# EAGLE schematic shiva (EAGLE 7.7.0)
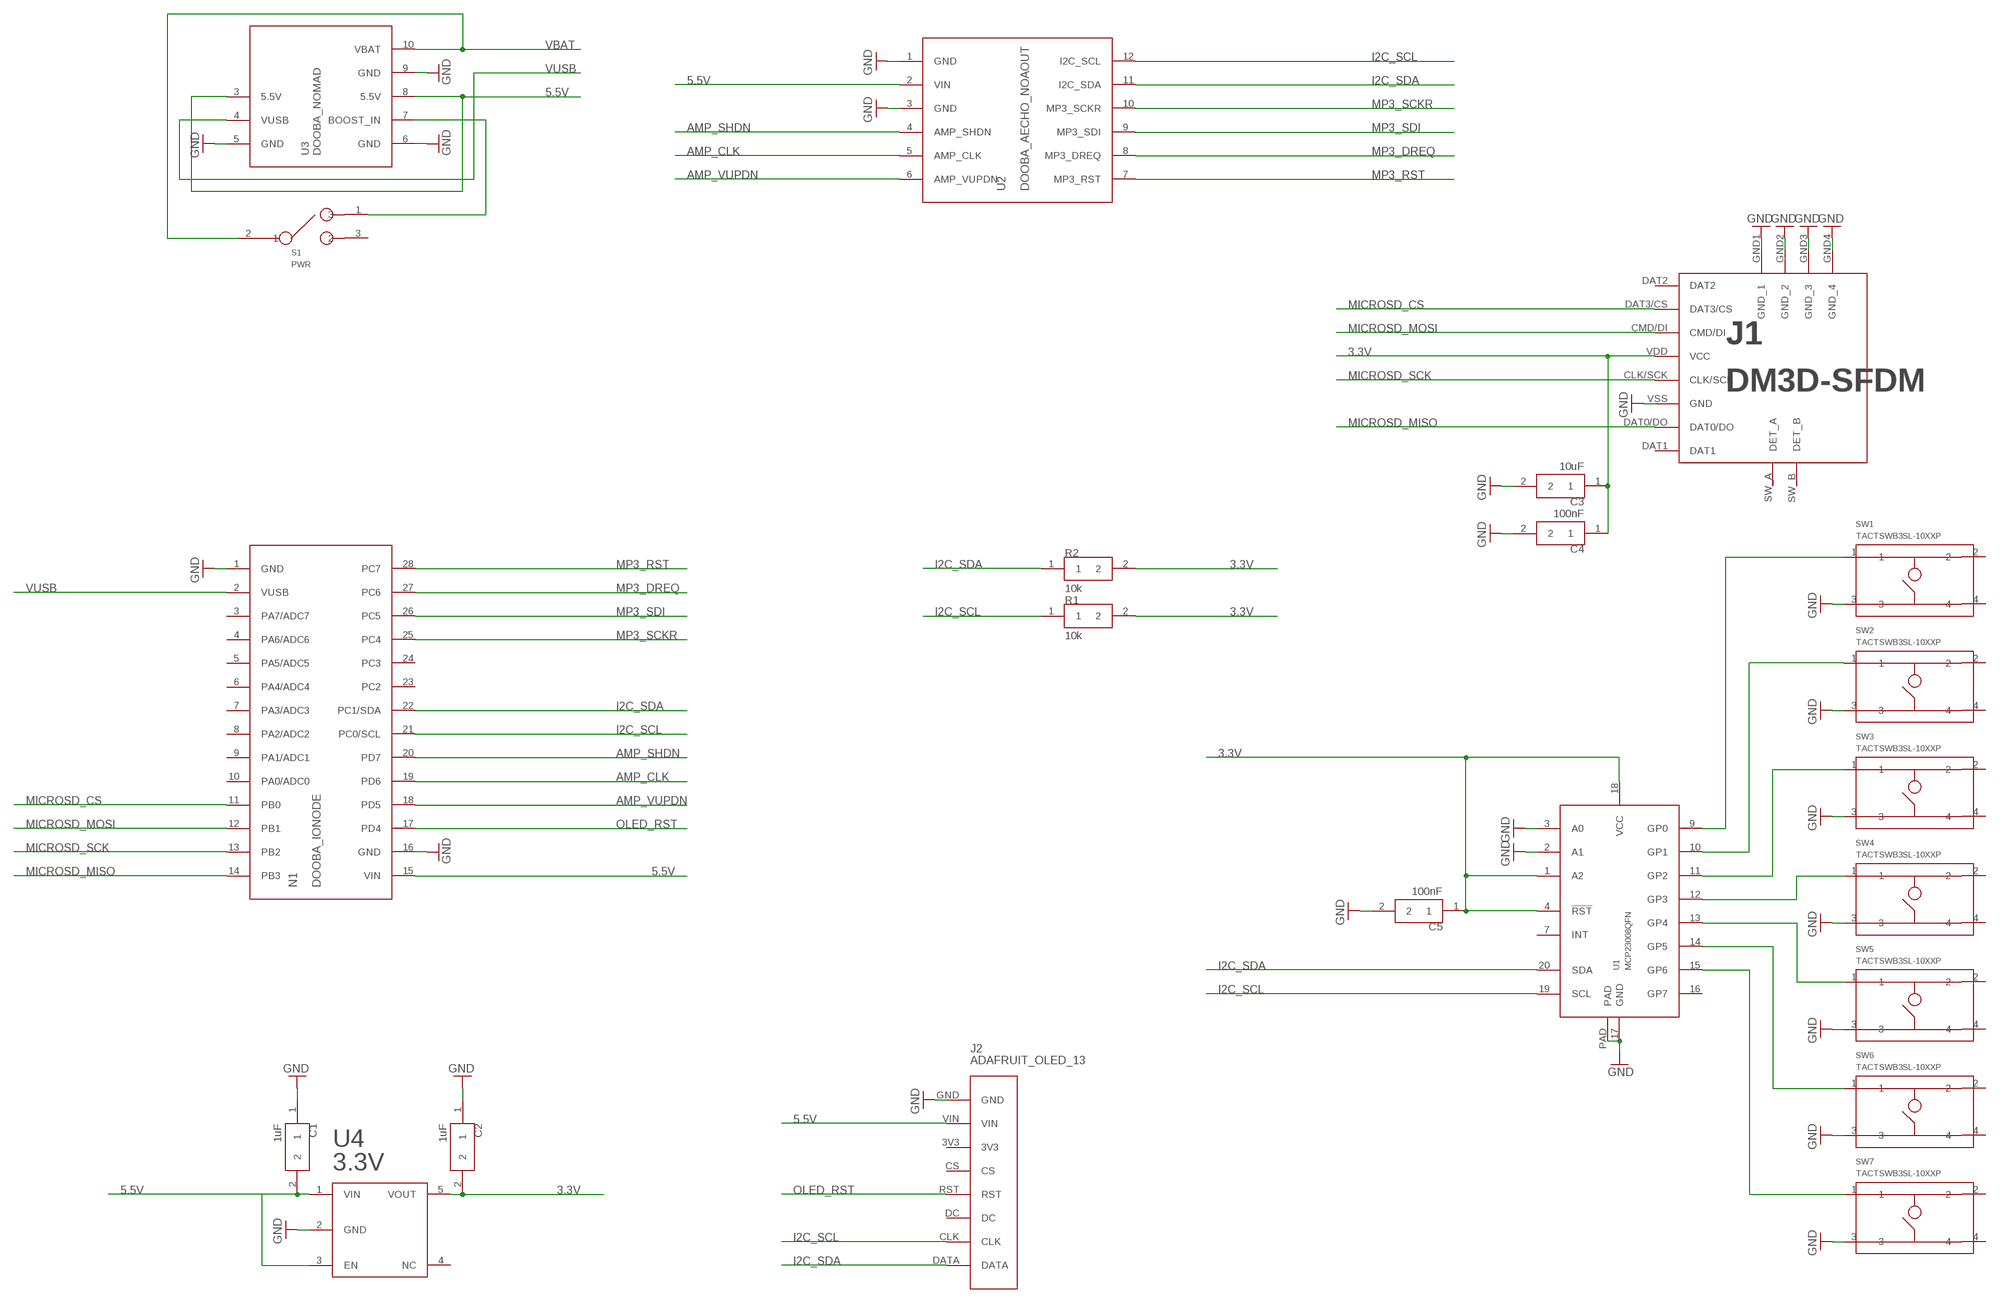
[diagram p0: schematic, sheet 1]

## Parts
C1  1uF  CAP0805  [0805]
C2  1uF  CAP0805  [0805]
C3  10uF  CAP0805  [0805]
C4  100nF  CAP0805  [0805]
C5  100nF  CAP0805  [0805]
J1  DM3D-SFDM  [DM3D-SF]
J2  ADAFRUIT_OLED_13  [ADAFRUIT_OLED_13]
N1  DOOBA_IONODE  [DOOBA_IONODE]
R1  10k  RES0805  [0805]
R2  10k  RES0805  [0805]
S1  PWR  SWITCH_SPDT  [JS102011]
SW1  TACTSWB3SL-10XXP  [B3SL-10XXP]
SW2  TACTSWB3SL-10XXP  [B3SL-10XXP]
SW3  TACTSWB3SL-10XXP  [B3SL-10XXP]
SW4  TACTSWB3SL-10XXP  [B3SL-10XXP]
SW5  TACTSWB3SL-10XXP  [B3SL-10XXP]
SW6  TACTSWB3SL-10XXP  [B3SL-10XXP]
SW7  TACTSWB3SL-10XXP  [B3SL-10XXP]
U1  MCP23008QFN  [20-VQFN]
U2  DOOBA_AECHO_NOAOUT  [DOOBA_AECHO_NOAOUT]
U3  DOOBA_NOMAD  [DOOBA_NOMAD]
U4  3.3V  LP3985SOT23-5  [SOT23-5]

## Nets
3.3V: C2.2 C3.1 C4.1 C5.1 J1.VDD(VCC) R1.2 R2.2 U1.1(A2) U1.4(!RST) U1.18(VCC) U4.5(VOUT)
5.5V: C1.2 J2.VIN N1.15(VIN) U2.2(VIN) U3.3(5.5V) U3.8(5.5V) U4.1(VIN) U4.3(EN)
AMP_CLK: N1.19(PD6) U2.5(AMP_CLK)
AMP_SHDN: N1.20(PD7) U2.4(AMP_SHDN)
AMP_VUPDN: N1.18(PD5) U2.6(AMP_VUPDN)
GND: C1.1 C2.1 C3.2 C4.2 C5.2 J1.GND1(GND_1) J1.GND2(GND_2) J1.GND3(GND_3) J1.GND4(GND_4) J1.VSS(GND) J2.GND N1.1(GND) N1.16(GND) SW1.3 SW2.3 SW3.3 SW4.3 SW5.3 SW6.3 SW7.3 U1.2(A1) U1.3(A0) U1.17(GND) U1.PAD U2.1(GND) U2.3(GND) U3.5(GND) U3.6(GND) U3.9(GND) U4.2(GND)
I2C_SCL: J2.CLK N1.21(PC0/SCL) R1.1 U1.19(SCL) U2.12(I2C_SCL)
I2C_SDA: J2.DATA N1.22(PC1/SDA) R2.1 U1.20(SDA) U2.11(I2C_SDA)
MICROSD_CS: J1.DAT3/CS N1.11(PB0)
MICROSD_MISO: J1.DAT0/DO N1.14(PB3)
MICROSD_MOSI: J1.CMD/DI N1.12(PB1)
MICROSD_SCK: J1.CLK/SCK N1.13(PB2)
MP3_DREQ: N1.27(PC6) U2.8(MP3_DREQ)
MP3_RST: N1.28(PC7) U2.7(MP3_RST)
MP3_SCKR: N1.25(PC4) U2.10(MP3_SCKR)
MP3_SDI: N1.26(PC5) U2.9(MP3_SDI)
N$1: SW1.1 U1.9(GP0)
N$2: SW2.1 U1.10(GP1)
N$3: SW3.1 U1.11(GP2)
N$4: SW4.1 U1.12(GP3)
N$5: SW5.1 U1.13(GP4)
N$6: SW6.1 U1.14(GP5)
N$7: SW7.1 U1.15(GP6)
N$11: S1.1 U3.7(BOOST_IN)
OLED_RST: J2.RST N1.17(PD4)
VBAT: S1.2 U3.10(VBAT)
VUSB: N1.2(VUSB) U3.4(VUSB)
Unconnected: J1.DAT1 J1.DAT2 J1.SW_A(DET_A) J1.SW_B(DET_B) J2.3V3 J2.CS J2.DC N1.3(PA7/ADC7) N1.4(PA6/ADC6) N1.5(PA5/ADC5) N1.6(PA4/ADC4) N1.7(PA3/ADC3) N1.8(PA2/ADC2) N1.9(PA1/ADC1) N1.10(PA0/ADC0) N1.23(PC2) N1.24(PC3) S1.3 SW1.2 SW1.4 SW2.2 SW2.4 SW3.2 SW3.4 SW4.2 SW4.4 SW5.2 SW5.4 SW6.2 SW6.4 SW7.2 SW7.4 U1.7(INT) U1.16(GP7) U4.4(NC)

## Library data of the parts
C1-C5 = dooba:CAP
J1 = dooba:DM3D-SF
J2 = dooba:ADAFRUIT_OLED_13
N1 = dooba:DOOBA_IONODE
R1 R2 = dooba:RES
S1 = dooba:SWITCH_SPDT
SW1-SW7 = dooba:TACTSW
U1 = dooba:MCP23008
U2 = dooba:DOOBA_AECHO_NOAOUT
U3 = dooba:DOOBA_NOMAD
U4 = dooba:LP3985